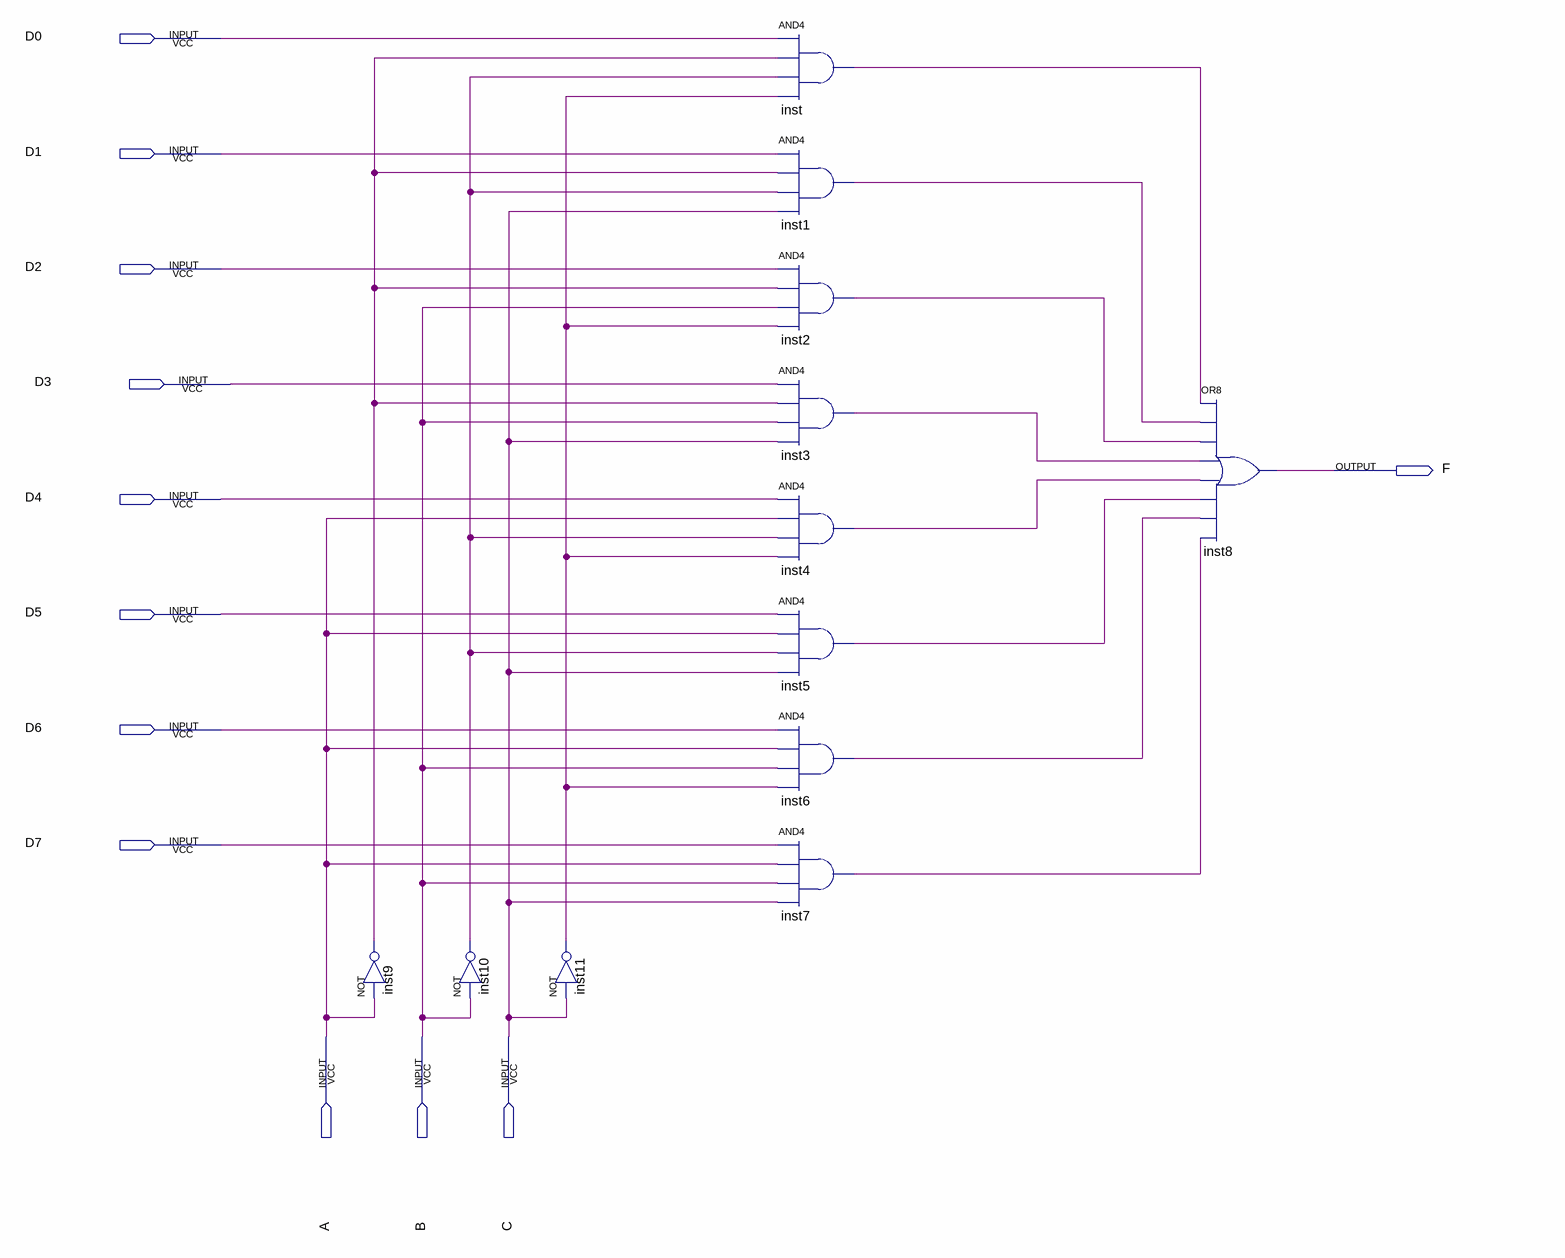
[diagram p0: schematic sheet]
// Quartus schematic Multiplexador_8x1.bdf as structural Verilog: 12 symbols, 12 pins
module Multiplexador_8x1 (
  input  D0,
  input  D1,
  input  D2,
  input  D3,
  input  D4,
  input  D5,
  input  D6,
  input  D7,
  input  A,
  input  B,
  input  C,
  output F
);

  wire inst1_out, inst2_out, inst3_out, inst4_out, inst5_out, inst6_out, inst7_out, inst9_out, inst10_out,
       inst11_out, inst_out;

  not inst9 (inst9_out, A);
  not inst10 (inst10_out, B);
  not inst11 (inst11_out, C);
  and inst (inst_out, D0, inst9_out, inst10_out, inst11_out);
  and inst1 (inst1_out, D1, inst9_out, inst10_out, C);
  and inst2 (inst2_out, D2, inst9_out, B, inst11_out);
  and inst3 (inst3_out, D3, inst9_out, B, C);
  and inst4 (inst4_out, D4, A, inst10_out, inst11_out);
  and inst5 (inst5_out, D5, A, inst10_out, C);
  and inst6 (inst6_out, D6, A, B, inst11_out);
  and inst7 (inst7_out, D7, A, B, C);
  or inst8 (F, inst_out, inst1_out, inst2_out, inst3_out, inst4_out, inst5_out, inst6_out, inst7_out);
endmodule
